# Altium project project_6.PrjPcb
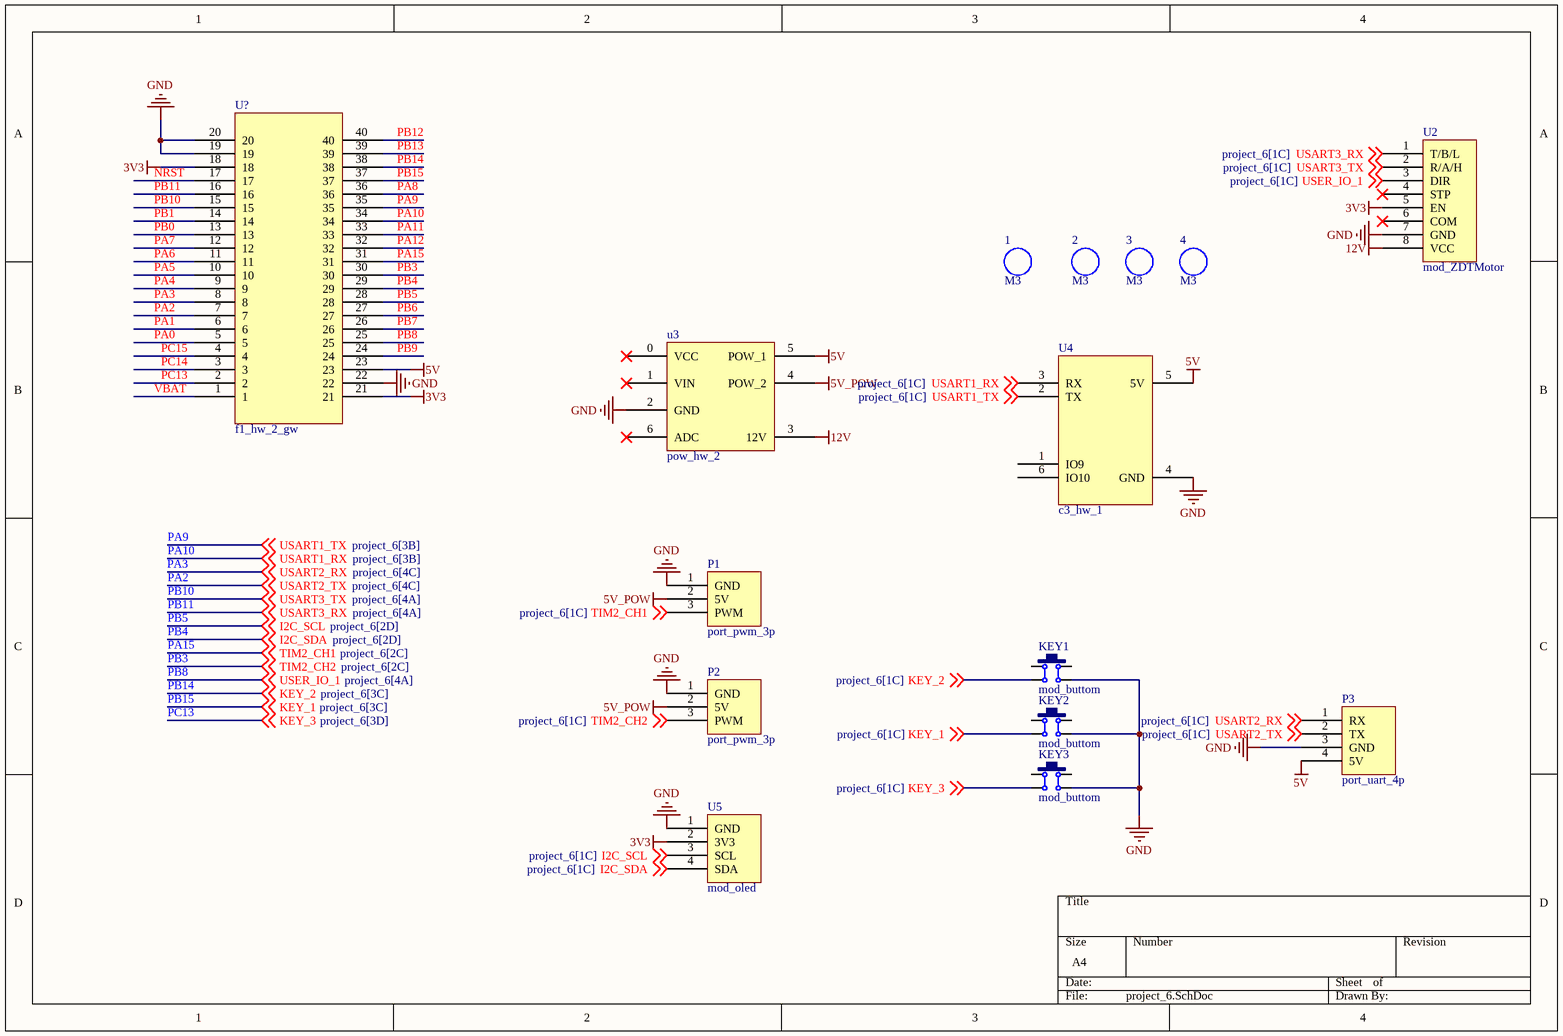
[diagram p0: project_6.SchDoc]
1 sheet, 15 parts. Net scope: global (net labels, ports and power ports of the same name join across sheets).
Board file: project_6.PcbDoc

## Sheet project_6.SchDoc
size A4; SheetNumber: 1; SheetTotal: 1

### Parts
1  M3  [M3 125X200]
2  M3  [M3 125X200]
3  M3  [M3 125X200]
4  M3  [M3 125X200]
KEY1  mod_buttom  [MOD_BUTTOM]
KEY2  mod_buttom  [MOD_BUTTOM]
KEY3  mod_buttom  [MOD_BUTTOM]
P1  port_pwm_3p  [XH2.54_3P]
P2  port_pwm_3p  [XH2.54_3P]
P3  port_uart_4p  [XH2.54_4P]
U2  mod_ZDTMotor  [XH2.54_8P]
u3  pow_hw_2  [POW_HW_2]
U4  c3_hw_1  [C3_HW_1]
U5  mod_oled  [MOD_OLED]
U?  f1_hw_2_gw  [F1_HW_2_GW]

### Nets
3V3: U2.5(EN) U5.2(3V3) U?.18 U?.21
5V: P3.4(5V) u3.5(POW_1) U4.5(5V) U?.23
5V_POW: P1.2(5V) P2.2(5V) u3.4(POW_2)
12V: U2.8(VCC) u3.3(12V)
GND: KEY1.3 KEY2.3 KEY3.3 P1.1(GND) P2.1(GND) P3.3(GND) U2.7(GND) u3.2(GND) U4.4(GND) U5.1(GND) U?.19 U?.20 U?.22
NRST: U?.17
PA0: U?.5
PA1: U?.6
PA2: P3.2(TX) U?.7 ; off-sheet USART2_TX  [also labelled USART2_TX]
PA3: U?.8
PA4: U?.9
PA5: U?.10
PA6: U?.11
PA7: U?.12
PA8: U?.36
PA9: U4.2(TX) U?.35 ; off-sheet USART1_TX  [also labelled USART1_TX]
PA10: U4.3(RX) U?.34 ; off-sheet USART1_RX  [also labelled USART1_RX]
PA11: U?.33
PA12: U?.32
PA15: P1.3(PWM) U?.31 ; off-sheet TIM2_CH1  [also labelled TIM2_CH1]
PB0: U?.13
PB1: U?.14
PB3: P2.3(PWM) U?.30 ; off-sheet TIM2_CH2  [also labelled TIM2_CH2]
PB4: U5.4(SDA) U?.29 ; off-sheet I2C_SDA  [also labelled I2C_SDA]
PB5: U5.3(SCL) U?.28 ; off-sheet I2C_SCL  [also labelled I2C_SCL]
PB6: U?.27
PB7: U?.26
PB8: U2.3(DIR) U?.25 ; off-sheet USER_IO_1  [also labelled USER_IO_1]
PB9: U?.24
PB10: U2.2(R/A/H) U?.15 ; off-sheet USART3_TX  [also labelled USART3_TX]
PB11: U2.1(T/B/L) U?.16 ; off-sheet USART3_RX  [also labelled USART3_RX]
PB12: U?.40
PB13: U?.39
PB14: KEY1.4 U?.38 ; off-sheet KEY_2  [also labelled KEY_2]
PB15: KEY2.4 U?.37 ; off-sheet KEY_1  [also labelled KEY_1]
PC13: KEY3.4 U?.2 ; off-sheet KEY_3  [also labelled KEY_3]
PC14: U?.3
PC15: U?.4
USART2_RX: P3.1(RX) ; off-sheet USART2_RX
VBAT: U?.1

Not connected (* = marked no-connect by the designer): KEY1 1 2; KEY2 1 2; KEY3 1 2; U2 4(STP)* 6(COM)*; u3 0(VCC)* 1(VIN)* 6(ADC)*; U4 1(IO9) 6(IO10)

### Notes on the sheet
- Labels drawn without touching a wire or pin: PA3

### Library data of the parts
1-4 = prot_m3: m3铜柱孔; BOM名称: 铜柱孔; 版权归属: 源创客; 学习资源: www.ooocke.com
KEY1-KEY3 = mod_buttom: 6*6*4.3按键
P1 P2 = port_pwm_3p: 舵机接口 / XH2.54弯排针3p
P3 = port_uart_4p: 串口接口/SPP蓝牙模块 / XH2.54弯排针4p/4p排母
U2 = mod_ZDTMotor: 闭环步进,10-29V
u3 = pow_hw_2: 两路升降压电源模块 / 6p排母*2
U4 = c3_hw_1: ESP32C3蓝牙模块 / 6p排母
U5 = mod_oled: oled模块 / 4p排母